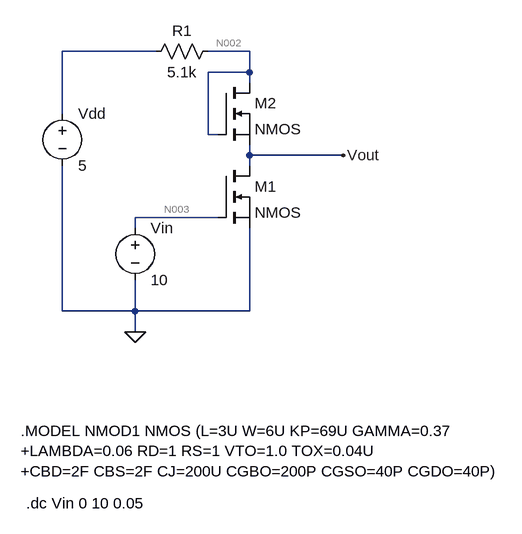
[diagram p0: schematic ee347_prelab2_1b.asc]
ee347_prelab2_1b.asc, the LTspice schematic file:
Version 4
SHEET 1 880 680
WIRE 144 -192 0 -192
WIRE 288 -192 224 -192
WIRE 288 -160 288 -192
WIRE 288 -160 224 -160
WIRE 288 -144 288 -160
WIRE 0 -96 0 -192
WIRE 224 -64 224 -160
WIRE 240 -64 224 -64
WIRE 288 -32 288 -48
WIRE 432 -32 288 -32
WIRE 288 -16 288 -32
WIRE 240 64 112 64
WIRE 112 80 112 64
WIRE 0 208 0 -16
WIRE 112 208 112 160
WIRE 112 208 0 208
WIRE 288 208 288 80
WIRE 288 208 112 208
WIRE 112 240 112 208
FLAG 112 240 0
FLAG 432 -32 Vout
SYMBOL voltage 112 64 R0
SYMATTR InstName Vin
SYMATTR Value 10
SYMBOL nmos 240 -16 R0
SYMATTR InstName M1
SYMBOL nmos 240 -144 R0
SYMATTR InstName M2
SYMBOL res 240 -208 R90
WINDOW 0 0 56 VBottom 2
WINDOW 3 32 56 VTop 2
SYMATTR InstName R1
SYMATTR Value 5.1k
SYMBOL voltage 0 -112 R0
SYMATTR InstName Vdd
SYMATTR Value 5
TEXT -64 392 Left 2 !.MODEL NMOD1 NMOS (L=3U W=6U KP=69U GAMMA=0.37\n+LAMBDA=0.06 RD=1 RS=1 VTO=1.0 TOX=0.04U\n+CBD=2F CBS=2F CJ=200U CGBO=200P CGSO=40P CGDO=40P)
TEXT -56 504 Left 2 !.dc Vin 0 10 0.05

The netlist it stands for:
* ee347_prelab2_1b.asc
Vin N003 0 10
M1 Vout N003 0 0 NMOS
M2 N002 N002 Vout Vout NMOS
R1 N002 N001 5.1k
Vdd N001 0 5
.model NMOS NMOS
.model PMOS PMOS
.lib standard.mos
.MODEL NMOD1 NMOS (L=3U W=6U KP=69U GAMMA=0.37
+LAMBDA=0.06 RD=1 RS=1 VTO=1.0 TOX=0.04U
+CBD=2F CBS=2F CJ=200U CGBO=200P CGSO=40P CGDO=40P)
.dc Vin 0 10 0.05
.backanno
.end

* Results of the author's LTspice run, read from the files saved beside the schematic
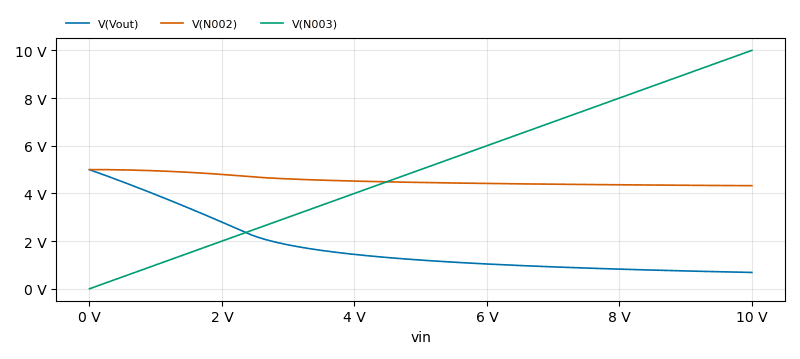
[diagram p1: DC transfer characteristic of ee347_prelab2_1b.asc, plotted from the saved traces]
* DC transfer characteristic, 1 run:
*   V(Vout): 4.995 V at vin=0 V, 685.6 mV at vin=10 V, min 685.6 mV, max 4.995 V
*   V(N002): 5 V at vin=0 V, 4.325 V at vin=10 V, min 4.325 V, max 5 V
*   V(N003): 0 V at vin=0 V, 10 V at vin=10 V, min 0 V, max 10 V